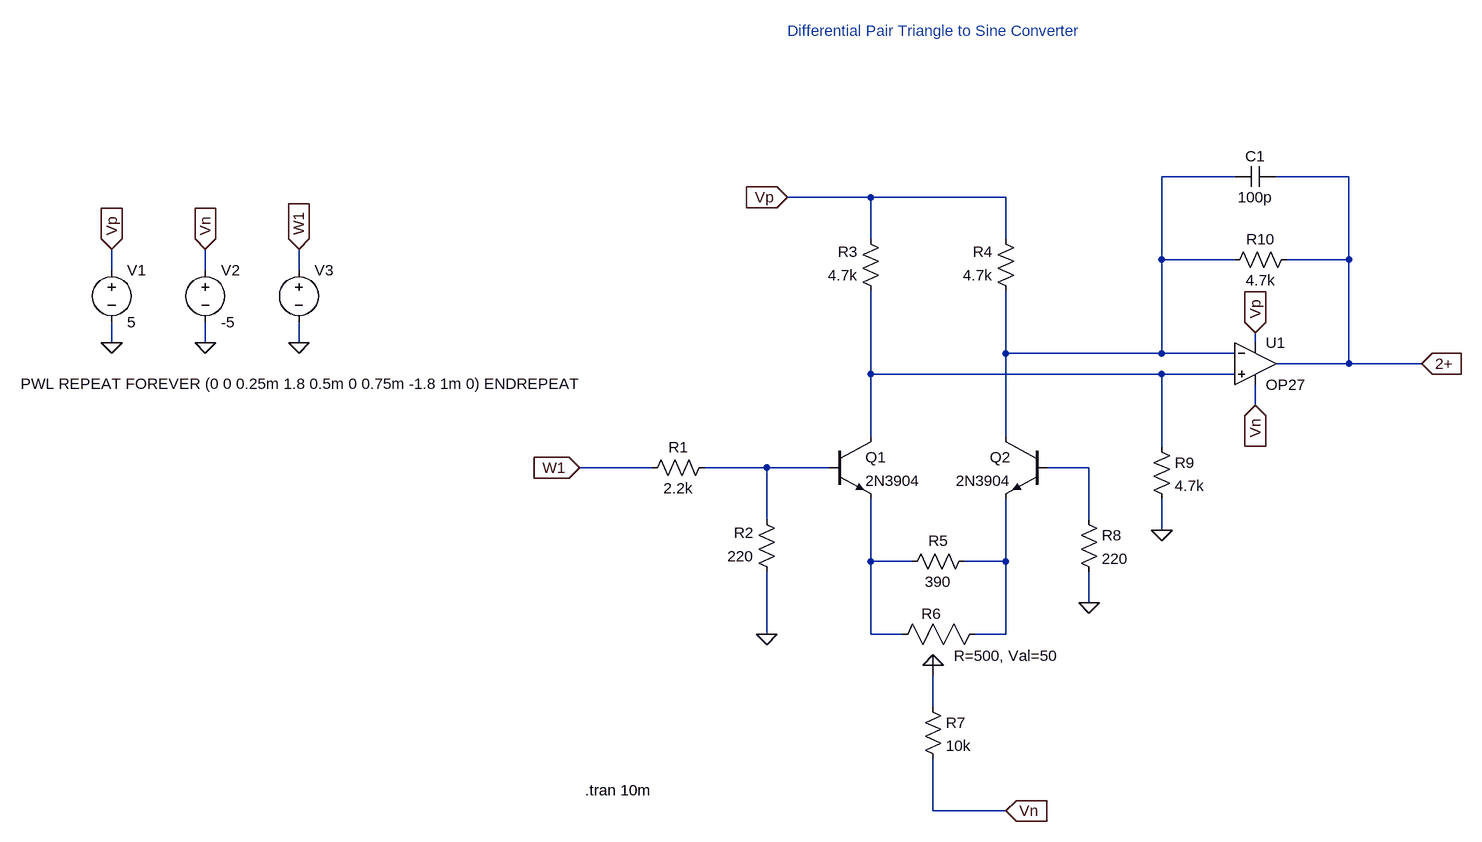
[diagram p0: schematic diffpair_triangle_to_sine_ltspice.asc]
diffpair_triangle_to_sine_ltspice.asc, the LTspice schematic file:
Version 4
SHEET 1 880 960
WIRE 128 -112 16 -112
WIRE 304 -112 192 -112
WIRE -432 -80 -560 -80
WIRE -224 -80 -432 -80
WIRE -432 -16 -432 -80
WIRE -224 -16 -224 -80
WIRE 16 16 16 -112
WIRE 128 16 16 16
WIRE 304 16 304 -112
WIRE 304 16 208 16
WIRE -1600 32 -1600 0
WIRE -1456 32 -1456 0
WIRE -1312 32 -1312 0
WIRE -1600 144 -1600 112
WIRE -1456 144 -1456 112
WIRE -1312 144 -1312 112
WIRE 160 144 160 128
WIRE -224 160 -224 64
WIRE 16 160 16 16
WIRE 16 160 -224 160
WIRE 128 160 16 160
WIRE 304 176 304 16
WIRE 304 176 192 176
WIRE 416 176 304 176
WIRE -432 192 -432 64
WIRE 16 192 -432 192
WIRE 128 192 16 192
WIRE 160 240 160 208
WIRE -432 288 -432 192
WIRE -224 288 -224 160
WIRE 16 304 16 192
WIRE -768 336 -880 336
WIRE -592 336 -688 336
WIRE -496 336 -592 336
WIRE -96 336 -160 336
WIRE -592 416 -592 336
WIRE -96 416 -96 336
WIRE 16 432 16 384
WIRE -432 480 -432 384
WIRE -368 480 -432 480
WIRE -224 480 -224 384
WIRE -224 480 -288 480
WIRE -96 544 -96 496
WIRE -592 592 -592 496
WIRE -432 592 -432 480
WIRE -384 592 -432 592
WIRE -224 592 -224 480
WIRE -224 592 -272 592
WIRE -336 704 -336 656
WIRE -336 864 -336 784
WIRE -224 864 -336 864
FLAG -96 544 0
FLAG 16 432 0
FLAG 160 128 Vp
IOPIN 160 128 In
FLAG 160 240 Vn
IOPIN 160 240 In
FLAG -560 -80 Vp
IOPIN -560 -80 In
FLAG -880 336 W1
IOPIN -880 336 In
FLAG -224 864 Vn
IOPIN -224 864 In
FLAG 416 176 2+
IOPIN 416 176 In
FLAG -592 592 0
FLAG -1600 144 0
FLAG -1456 144 0
FLAG -1312 144 0
FLAG -1600 0 Vp
IOPIN -1600 0 In
FLAG -1456 0 Vn
IOPIN -1456 0 In
FLAG -1312 0 W1
IOPIN -1312 0 In
SYMBOL Opamps\\OP27 160 112 R0
SYMATTR InstName U1
SYMBOL npn -496 288 R0
SYMATTR InstName Q1
SYMATTR Value 2N3904
SYMBOL npn -160 288 M0
SYMATTR InstName Q2
SYMATTR Value 2N3904
SYMBOL res -672 320 R90
WINDOW 0 0 56 VBottom 2
WINDOW 3 32 56 VTop 2
SYMATTR InstName R1
SYMATTR Value 2.2k
SYMBOL res -576 512 R180
WINDOW 0 36 76 Left 2
WINDOW 3 36 40 Left 2
SYMATTR InstName R2
SYMATTR Value 220
SYMBOL res -416 80 R180
WINDOW 0 36 76 Left 2
WINDOW 3 36 40 Left 2
SYMATTR InstName R3
SYMATTR Value 4.7k
SYMBOL res -208 80 R180
WINDOW 0 36 76 Left 2
WINDOW 3 36 40 Left 2
SYMATTR InstName R4
SYMATTR Value 4.7k
SYMBOL res -384 496 R270
WINDOW 0 32 56 VTop 2
WINDOW 3 0 56 VBottom 2
SYMATTR InstName R5
SYMATTR Value 390
SYMBOL res -352 688 R0
SYMATTR InstName R7
SYMATTR Value 10k
SYMBOL res -112 400 R0
SYMATTR InstName R8
SYMATTR Value 220
SYMBOL res 0 288 R0
SYMATTR InstName R9
SYMATTR Value 4.7k
SYMBOL res 224 0 R90
WINDOW 0 0 56 VBottom 2
WINDOW 3 32 56 VTop 2
SYMATTR InstName R10
SYMATTR Value 4.7k
SYMBOL cap 192 -128 R90
WINDOW 0 0 32 VBottom 2
WINDOW 3 32 32 VTop 2
SYMATTR InstName C1
SYMATTR Value 100p
SYMBOL potentiometer -368 608 R270
WINDOW 0 47 14 VRight 2
WINDOW 39 -17 64 VRight 2
SYMATTR InstName R6
SYMATTR SpiceLine R=500, Val=50
SYMBOL voltage -1600 16 R0
WINDOW 123 0 0 Left 0
WINDOW 39 0 0 Left 0
SYMATTR InstName V1
SYMATTR Value 5
SYMBOL voltage -1456 16 R0
WINDOW 123 0 0 Left 0
WINDOW 39 0 0 Left 0
SYMATTR InstName V2
SYMATTR Value -5
SYMBOL voltage -1312 16 R0
WINDOW 3 -428 191 Left 2
SYMATTR InstName V3
SYMATTR Value PWL REPEAT FOREVER (0 0 0.25m 1.8 0.5m 0 0.75m -1.8 1m 0) ENDREPEAT
TEXT -872 832 Left 2 !.tran 10m
TEXT -560 -336 Left 2 ;Differential Pair Triangle to Sine Converter

The netlist it stands for:
* diffpair_triangle_to_sine_ltspice.asc
XU1 N002 N001 Vp Vn 2+ OP27  ; pins In+ In- V+ V- OUT
Q1 N002 N003 N005 0 2N3904
Q2 N001 N004 N006 0 2N3904
R1 N003 W1 2.2k
R2 0 N003 220
R3 N002 Vp 4.7k
R4 N001 Vp 4.7k
R5 N005 N006 390
R7 N007 Vn 10k
R8 N004 0 220
R9 N002 0 4.7k
R10 2+ N001 4.7k
C1 2+ N001 100p
XR6 N005 N007 N006 potentiometer R=500, Val=50  ; pins 1 2 3
V1 Vp 0 5
V2 Vn 0 -5
V3 W1 0 PWL REPEAT FOREVER (0 0 0.25m 1.8 0.5m 0 0.75m -1.8 1m 0) ENDREPEAT
.model NPN NPN
.model PNP PNP
.lib standard.bjt
.tran 10m
* Differential Pair Triangle to Sine Converter
.lib ADI.lib
.backanno
.end